# EAGLE design main (EAGLE 9.6.2)
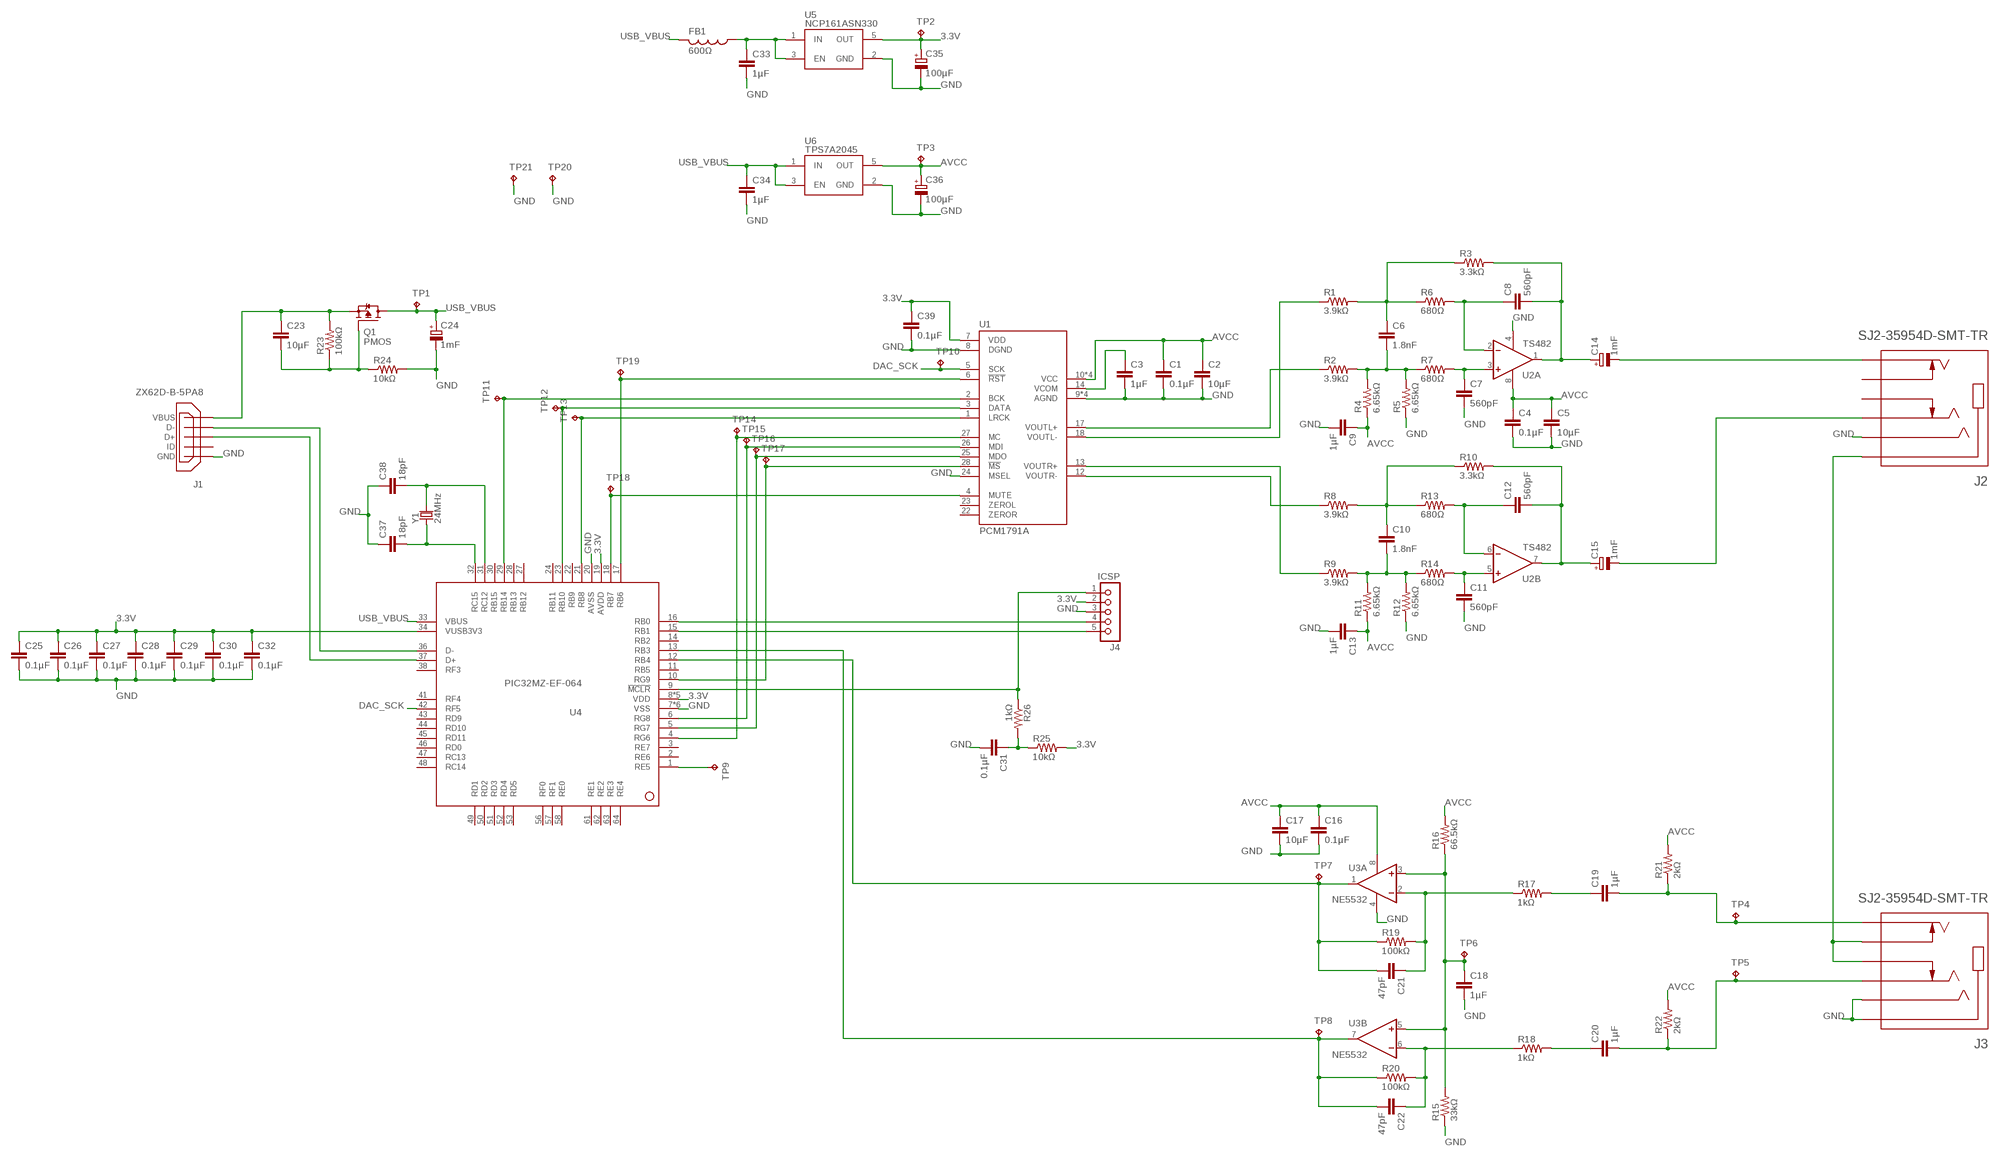
[diagram p0: schematic, sheet 1]

## Parts
C1  0.1µF  C-EUC0603  [C0603]
C2  10µF  C-EUC0805  [C0805]
C3  1µF  C-EUC0805  [C0805]
C4  0.1µF  C-EUC0603  [C0603]
C5  10µF  C-EUC0805  [C0805]
C6  1.8nF  C-EUC0603  [C0603]
C7  560pF  C-EUC0603  [C0603]
C8  560pF  C-EUC0603  [C0603]
C9  1µF  C-EUC0805  [C0805]
C10  1.8nF  C-EUC0603  [C0603]
C11  560pF  C-EUC0603  [C0603]
C12  560pF  C-EUC0603  [C0603]
C13  1µF  C-EUC0805  [C0805]
C14  1mF  CAP-E3,5-8-16-HORZ  [E3,5-8-16-HORZ]
C15  1mF  CAP-E3,5-8-16-HORZ  [E3,5-8-16-HORZ]
C16  0.1µF  C-EUC0603  [C0603]
C17  10µF  C-EUC0805  [C0805]
C18  1µF  C-EUC0805  [C0805]
C19  1µF  C-EU050-050X075  [C050-050X075]
C20  1µF  C-EU050-050X075  [C050-050X075]
C21  47pF  C-EU050-045X075  [C050-045X075]
C22  47pF  C-EU050-045X075  [C050-045X075]
C23  10µF  C-EUC0805  [C0805]
C24  1mF  CAP-E3,5-8-16-HORZ  [E3,5-8-16-HORZ]
C25  0.1µF  C-EUC0603  [C0603]
C26  0.1µF  C-EUC0603  [C0603]
C27  0.1µF  C-EUC0603  [C0603]
C28  0.1µF  C-EUC0603  [C0603]
C29  0.1µF  C-EUC0603  [C0603]
C30  0.1µF  C-EUC0603  [C0603]
C31  0.1µF  C-EUC0603  [C0603]
C32  0.1µF  C-EUC0603  [C0603]
C33  1µF  C-EUC0805  [C0805]
C34  1µF  C-EUC0805  [C0805]
C35  100µF  CPOL-EUD  [PANASONIC_D]
C36  100µF  CPOL-EUD  [PANASONIC_D]
C37  18pF  C-EUC0603  [C0603]
C38  18pF  C-EUC0603  [C0603]
C39  0.1µF  C-EUC0603  [C0603]
FB1  600Ω  0603-FERRITE  [C0603]
J1  ZX62D-B-5PA8  [ZX62D-B-5PA8]
J2  SJ2-35954D-SMT-TR  [CUI_SJ2-35954D-SMT-TR]
J3  SJ2-35954D-SMT-TR  [CUI_SJ2-35954D-SMT-TR]
J4  ICSP  5PIN-1.27  [5PIN-1.27]
Q1  PMOS  SOT23-P-MOSFET  [SOT23]
R1  3.9kΩ  R-US_R0603  [R0603]
R2  3.9kΩ  R-US_R0603  [R0603]
R3  3.3kΩ  R-US_R0603  [R0603]
R4  6.65kΩ  R-US_R0603  [R0603]
R5  6.65kΩ  R-US_R0603  [R0603]
R6  680Ω  R-US_R0603  [R0603]
R7  680Ω  R-US_R0603  [R0603]
R8  3.9kΩ  R-US_R0603  [R0603]
R9  3.9kΩ  R-US_R0603  [R0603]
R10  3.3kΩ  R-US_R0603  [R0603]
R11  6.65kΩ  R-US_R0603  [R0603]
R12  6.65kΩ  R-US_R0603  [R0603]
R13  680Ω  R-US_R0603  [R0603]
R14  680Ω  R-US_R0603  [R0603]
R15  33kΩ  R-US_R0603  [R0603]
R16  66.5kΩ  R-US_R0603  [R0603]
R17  1kΩ  R-US_R0603  [R0603]
R18  1kΩ  R-US_R0603  [R0603]
R19  100kΩ  R-US_R0603  [R0603]
R20  100kΩ  R-US_R0603  [R0603]
R21  2kΩ  R-US_R0603  [R0603]
R22  2kΩ  R-US_R0603  [R0603]
R23  100kΩ  R-US_R0603  [R0603]
R24  10kΩ  R-US_R0603  [R0603]
R25  10kΩ  R-US_R0603  [R0603]
R26  1kΩ  R-US_R0603  [R0603]
TP1  RCU-0(J)  [TP_0603_JOINED]
TP2  RCU-0(J)  [TP_0603_JOINED]
TP3  RCU-0(J)  [TP_0603_JOINED]
TP4  RCU-0(J)  [TP_0603_JOINED]
TP5  RCU-0(J)  [TP_0603_JOINED]
TP6  RCU-0(J)  [TP_0603_JOINED]
TP7  RCU-0(J)  [TP_0603_JOINED]
TP8  RCU-0(J)  [TP_0603_JOINED]
TP9  RCU-0(J)  [TP_0603_JOINED]
TP10  RCU-0(J)  [TP_0603_JOINED]
TP11  RCU-0(J)  [TP_0603_JOINED]
TP12  RCU-0(J)  [TP_0603_JOINED]
TP13  RCU-0(J)  [TP_0603_JOINED]
TP14  RCU-0(J)  [TP_0603_JOINED]
TP15  RCU-0(J)  [TP_0603_JOINED]
TP16  RCU-0(J)  [TP_0603_JOINED]
TP17  RCU-0(J)  [TP_0603_JOINED]
TP18  RCU-0(J)  [TP_0603_JOINED]
TP19  RCU-0(J)  [TP_0603_JOINED]
TP20  RCU-0(J)  [TP_0603_JOINED]
TP21  RCU-0(J)  [TP_0603_JOINED]
U1  PCM1791A  [SSOP28]
U2  TS482  [MSOP8]
U3  NE5532  [SOIC8]
U4  PIC32MZ-EF-064  [TQFP64-10X10X1MM]
U5  NCP161ASN330  SOT23-5-LDO  [SOT23-5L]
U6  TPS7A2045  SOT23-5-LDO  [SOT23-5L]
Y1  24MHz  HC49/4HSMX-CRYSTAL  [HC49/4HSMX]

## Nets
3.3V: C25.1 C26.1 C27.1 C28.1 C29.1 C30.1 C32.1 C35.+ C39.1 J4.2 R25.2 TP2.1(TP) U1.7(VDD) U4.8(VDD) U4.19(AVDD) U4.26(VDD) U4.34(VUSB3V3) U4.39(VDD) U4.54(VDD) U4.60(VDD) U5.5(OUT)
3V3REG_IN: C33.1 FB1.1 U5.1(IN) U5.3(EN)
!MCLR: J4.1 R26.1 U4.9(!MCLR)
!MCLR!_FILTER: C31.1 R25.1 R26.2
AMP_L_+: C7.1 R7.2 U2.3(A:+IN)
AMP_L_-: C8.1 R6.2 U2.2(A:-IN)
AMP_L_OUT: C8.2 C14.+ R3.2 U2.1(A:OUT)
AMP_L_SUM_+: C6.2 R2.2 R4.2 R5.2 R7.1
AMP_L_SUM_-: C6.1 R1.2 R3.1 R6.1
AMP_R_+: C11.1 R14.2 U2.5(B:+IN)
AMP_R_-: C12.1 R13.2 U2.6(B:-IN)
AMP_R_OUT: C12.2 C15.+ R10.2 U2.7(B:OUT)
AMP_R_SUM_+: C10.2 R9.2 R11.2 R12.2 R14.1
AMP_R_SUM_-: C10.1 R8.2 R10.1 R13.1
AVCC: C1.1 C2.1 C4.1 C5.1 C9.1 C13.1 C16.1 C17.1 C36.+ R4.1 R11.1 R16.2 R21.2 R22.2 TP3.1(TP) U1.10(VCC) U1.15(VCC) U1.20(VCC) U1.21(VCC) U2.8(A:V+) U3.8(A:V+) U6.5(OUT)
DAC_!MS: TP17.1(TP) U1.28(!MS) U4.10(RG9)
DAC_!RST: TP19.1(TP) U1.6(!RST) U4.17(RB6)
DAC_BCK: TP11.1(TP) U1.2(BCK) U4.29(RB14)
DAC_DATA: TP12.1(TP) U1.3(DATA) U4.23(RB10)
DAC_LRCK: TP13.1(TP) U1.1(LRCK) U4.21(RB8)
DAC_MC: TP14.1(TP) U1.27(MC) U4.4(RG6)
DAC_MISO: TP16.1(TP) U1.25(MDO) U4.5(RG7)
DAC_MOSI: TP15.1(TP) U1.26(MDI) U4.6(RG8)
DAC_MUTE: TP18.1(TP) U1.4(MUTE) U4.18(RB7)
DAC_SCK: TP10.1(TP) U1.5(SCK) U4.42(RF5)
DAC_VCOM: C3.1 U1.14(VCOM)
DAC_VOUTL+: R2.1 U1.17(VOUTL+)
DAC_VOUTL-: R1.1 U1.18(VOUTL-)
DAC_VOUTR+: R9.1 U1.13(VOUTR+)
DAC_VOUTR-: R8.1 U1.12(VOUTR-)
DEBUG_UART: TP9.1(TP) U4.1(RE5)
GND: C1.2 C2.2 C3.2 C4.2 C5.2 C7.2 C9.2 C11.2 C13.2 C16.2 C17.2 C18.2 C24.- C25.2 C26.2 C27.2 C28.2 C29.2 C30.2 C31.2 C32.2 C33.2 C34.2 C35.- C36.- C37.1 C38.1 C39.2 J1.5(GND) J1.S1(GND) J1.S2(GND) J1.S3(GND) J1.S4(GND) J2.4(RING2) J3.1(SLEEVE) J3.4(RING2) J4.3 R5.1 R12.1 R15.1 R24.2 TP20.1(TP) TP21.1(TP) U1.8(DGND) U1.9(AGND) U1.11(AGND) U1.16(AGND) U1.19(AGND) U1.24(MSEL) U2.4(A:V-) U3.4(A:V-) U4.7(VSS) U4.20(AVSS) U4.25(VSS) U4.35(VSS) U4.40(VSS) U4.55(VSS) U4.59(VSS) U5.2(GND) U6.2(GND)
HP_L: C14.- J2.2(TIP)
HP_R: C15.- J2.3(RING1)
MIC_ALT: J2.1(SLEEVE) J3.10(TIP_SWITCH) J3.11(RING1_SWITCH)
MIC_AMP_BIAS: C18.1 R15.2 R16.1 TP6.1(TP) U3.3(A:+IN) U3.5(B:+IN)
MIC_L: C19.2 J3.2(TIP) R21.1 TP4.1(TP)
MIC_L_AMPIN: C21.1 R17.1 R19.2 U3.2(A:-IN)
MIC_L_AMPOUT: C21.2 R19.1 TP7.1(TP) U3.1(A:OUT) U4.12(RB4)
MIC_L_COUPLED: C19.1 R17.2
MIC_R: C20.2 J3.3(RING1) R22.1 TP5.1(TP)
MIC_R_AMPIN: C22.1 R18.1 R20.2 U3.6(B:-IN)
MIC_R_AMPOUT: C22.2 R20.1 TP8.1(TP) U3.7(B:OUT) U4.13(RB3)
MIC_R_COUPLED: C20.1 R18.2
OSC1: C38.2 U4.31(RC12) Y1.2
OSC2: C37.2 U4.32(RC15) Y1.1
PGEC: J4.5 U4.15(RB1)
PGED: J4.4 U4.16(RB0)
USB_D+: J1.3(D+) U4.37(D+)
USB_D-: J1.2(D-) U4.36(D-)
USB_VBUS: C24.+ C34.1 FB1.2 Q1.3(D) TP1.1(TP) U4.33(VBUS) U6.1(IN) U6.3(EN)
USB_VBUS_RAMP: C23.2 Q1.1(G) R23.1 R24.1
USB_VBUS_RAW: C23.1 J1.1(VBUS) Q1.2(S) R23.2
Unconnected: J1.4(ID) J2.10(TIP_SWITCH) J2.11(RING1_SWITCH) U1.22(ZEROR) U1.23(ZEROL) U4.2(RE6) U4.3(RE7) U4.11(RB5) U4.14(RB2) U4.22(RB9) U4.24(RB11) U4.27(RB12) U4.28(RB13) U4.30(RB15) U4.38(RF3) U4.41(RF4) U4.43(RD9) U4.44(RD10) U4.45(RD11) U4.46(RD0) U4.47(RC13) U4.48(RC14) U4.49(RD1) U4.50(RD2) U4.51(RD3) U4.52(RD4) U4.53(RD5) U4.56(RF0) U4.57(RF1) U4.58(RE0) U4.61(RE1) U4.62(RE2) U4.63(RE3) U4.64(RE4)

## Library data of the parts
C1-C13 C16-C23 C25-C34 C37-C39 = rcl:C-EU: CAPACITOR, European symbol; SPICEPREFIX: C
C14 C15 C24 = BW-PassiveMechanical:CAP-E3,5-8-16-HORZ: Electrolytic capacitor, grid 3.5mm, diameter 8mm, length 16mm, horizontal mount
C35 C36 = rcl:CPOL-EU: POLARIZED CAPACITOR, European symbol; SPICEPREFIX: C
FB1 = BW-PassiveMechanical:0603-FERRITE
J1 = BW-Connectors:ZX62D-B-5PA8: Micro-USB connector, bottom mount
J2 J3 = BW-Connectors:SJ2-35954D-SMT-TR: 4 conductors, 3.5mm, SMT Audio Jack w/ 2 Switch; MANUFACTURER: CUI; PARTREV: 1.01; STANDARD: Manufacturer recommendation
J4 = BW-Connectors:5PIN-1.27: 5 pin header with 1.27mm pitch
Q1 = BW-Active:SOT23-P-MOSFET
R1-R26 = resistor:R-US_: RESISTOR, American symbol
TP1-TP21 = BW-PassiveMechanical:RCU-0: Solderable probe pad in 0603 form
U1 = BW-Active:PCM1791A: Audio DAC 24Bit 192kHz
U2 = BW-Active:TS482: 100mW Stereo Headphone Amplifier
U3 = BW-Active:NE5532: Dual OpAmp, Low noise
U4 = BW-Active:PIC32MZ-EF-064: 32-bit 200MHz microcontroller, 64-pin
U5 U6 = BW-Active:SOT23-5-LDO
Y1 = BW-PassiveMechanical:HC49/4HSMX-CRYSTAL

## Board
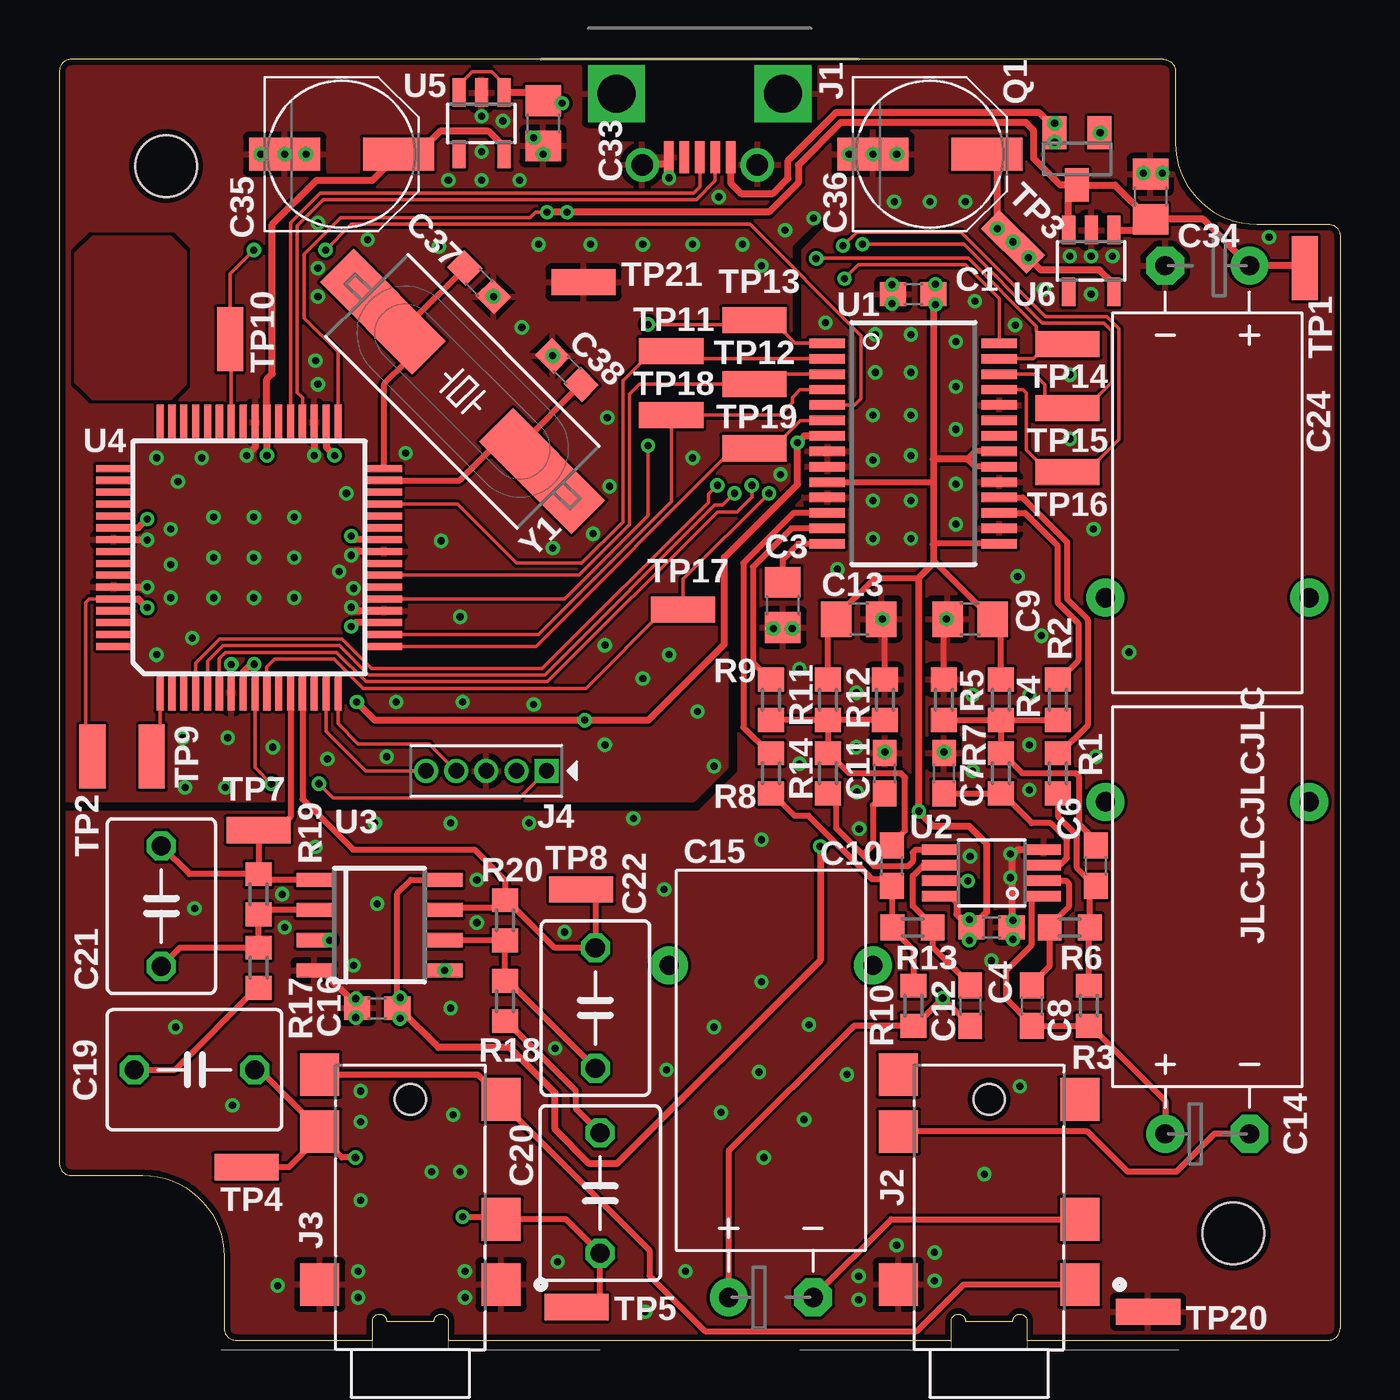
[diagram p1: board, top side]
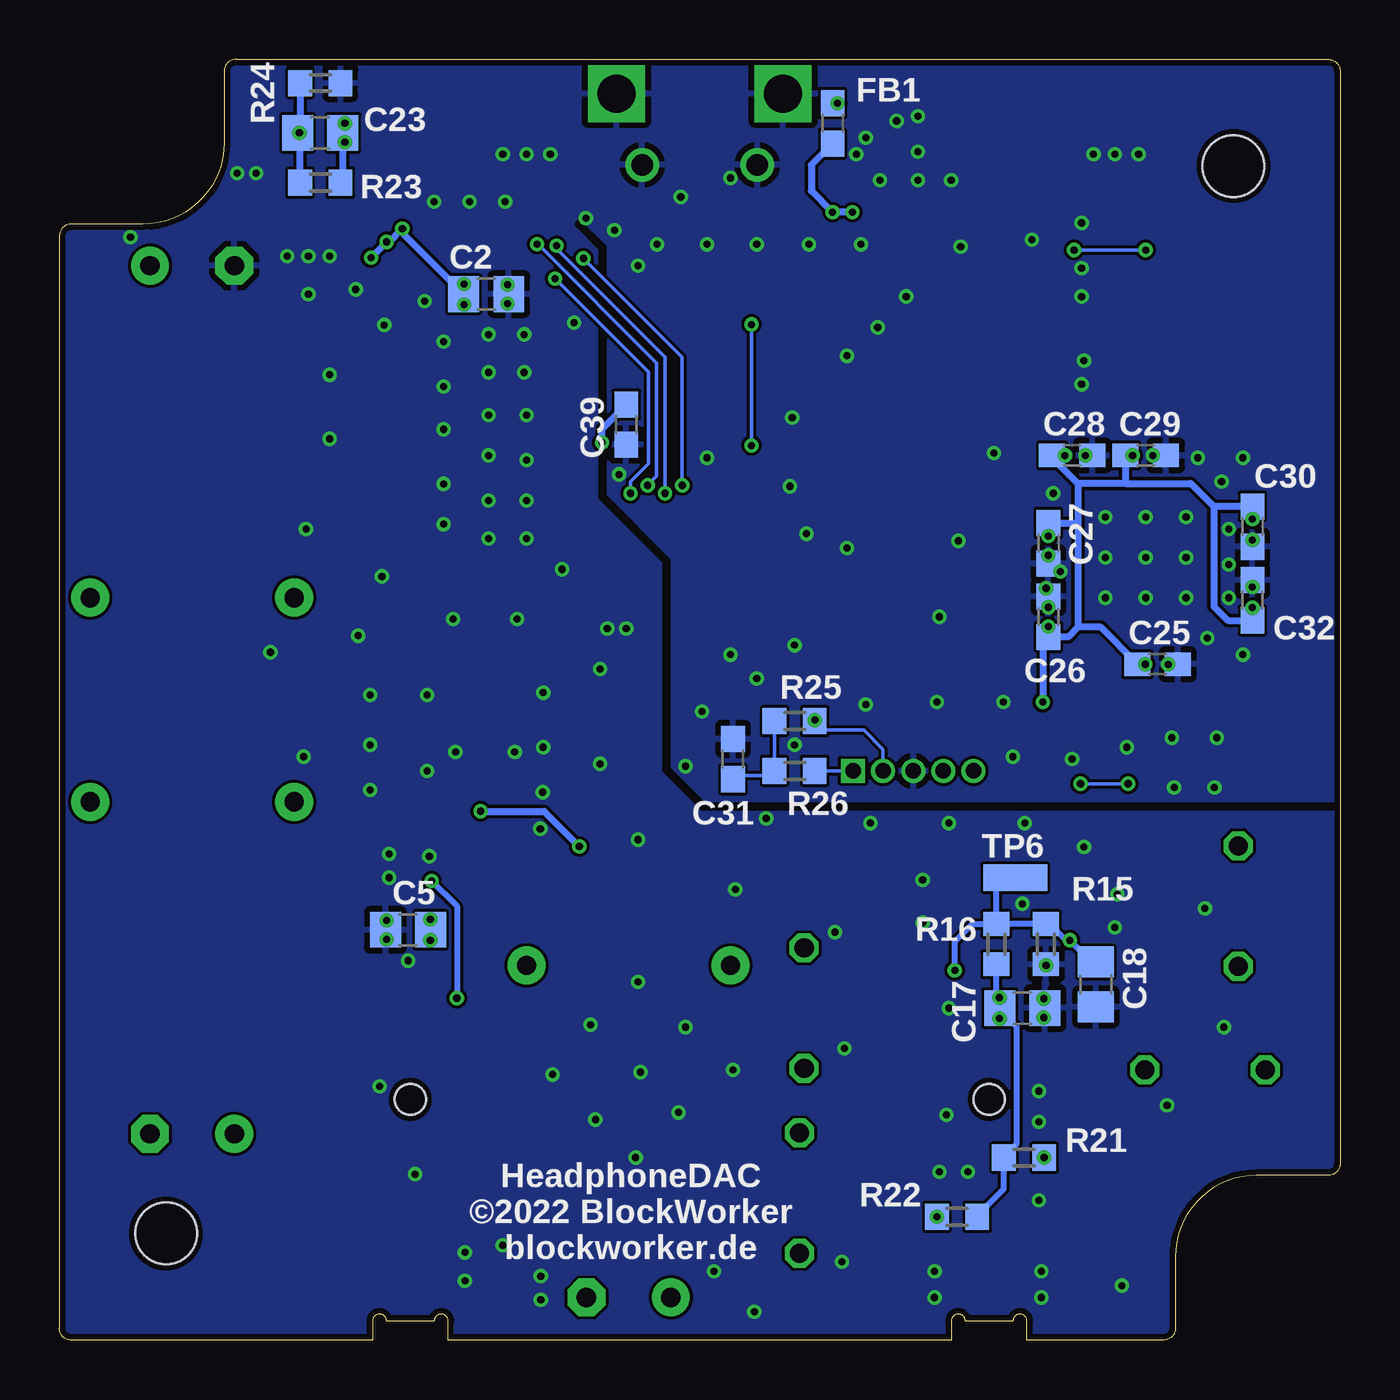
[diagram p2: board, bottom side, seen from below]

Size 54 x 54 mm. Coordinates in mm from the lower left corner, seen from the top.
Outline: 0.5,6.95 3.52,6.95 arc-90 6.95,3.52 6.95,0.5 arc90 7.45,0 13.2,0 13.2,0.8 arc-180 13.8,0.8 15.8,0.8 arc-180 16.4,0.8 16.4,0 37.6,0 37.6,0.8 arc-180 38.2,0.8 40.2,0.8 arc-180 40.8,0.8 40.8,0 53.5,0 arc90 54,0.5 54,46.55 arc90 53.5,47.05 50.48,47.05 arc-90 47.05,50.48 47.05,53.5 arc90 46.55,54 0.5,54 arc90 0,53.5 0,7.45 arc90 0.5,6.95
Copper layers (1*16): Top 0.035mm / dielectric 1.6mm / Bottom 0.035mm
Design rules "jlcpcb-2l": minimum track width 5mil, minimum drill 0.3mm, track to track 5mil, track to pad 5mil, pad to pad 5mil, via to via 5mil, smd to smd 0mil, copper to edge 0.25mm, drill to drill 0.5mm, minimum pad ring 0.15mm, minimum via ring 0.15mm, stop-mask expansion 4mil, vias tented up to drill 0.3mm, thermal gap 10mil
Holes 2.6 mm at 4.5,49.5 49.5,4.5
tKeepout: area 46.5,1.5 to 52.5,7.5; area 1.5,46.5 to 7.5,52.5

### Footprints (pad centres in the part's own frame; a part is rotated, then mirrored left to right if it is on the bottom)
C0603 = smd 1.1 x 1: 1 -0.85,0; 2 0.85,0
C0805 = smd 1.3 x 1.5: 1 -0.95,0; 2 0.95,0
E3,5-8-16-HORZ = drill 0.813 pad 1.6: + -1.778,0; M1 -4.3,14; M2 4.3,14 | drill 0.813 pad 1.6 octagon: - 1.778,0
C050-050X075 = drill 0.813 octagon: 1 -2.54,0; 2 2.54,0
C050-045X075 = drill 0.813 octagon: 1 -2.54,0; 2 2.54,0
PANASONIC_D = smd 3 x 1.4: + 2.4,0; - -2.4,0
ZX62D-B-5PA8 = smd 0.4 x 1.35: 1 3.4,4.125; 2 4.05,4.125; 3 4.7,4.125; 4 5.35,4.125; 5 6,4.125 | drill 1.6 pad 2.375 square: S1 1.188,1.45; S2 8.213,1.45 | drill 0.9 pad 1.4: S3 2.275,4.45; S4 7.125,4.45
CUI_SJ2-35954D-SMT-TR = smd 1.8 x 1.65: 1 -3.25,-3.825; 2 3.2,3.825; 3 -0.5,-3.825; 4 -3.25,3.825; 10 5.6,3.825; 11 4.55,-3.825 | hole 1.3: 4.55,0
5PIN-1.27 = drill 0.65 pad 1.016 square: 1 -2.54,0 | drill 0.65 pad 1.016: 2 -1.27,0; 3 0,0; 4 1.27,0; 5 2.54,0
SOT23 = smd 1 x 1.4: 1 -0.95,-1.1; 2 0.95,-1.1; 3 0,1.1
R0603 = smd 1 x 1.1: 1 -0.85,0; 2 0.85,0
TP_0603_JOINED = smd 2.7 x 1.1: 1 0,0
SSOP28 = smd 0.4 x 1.5: 1 -4.225,-3.625; 2 -3.575,-3.625; 3 -2.925,-3.625; 4 -2.275,-3.625; 5 -1.625,-3.625; 6 -0.975,-3.625; 7 -0.325,-3.625; 8 0.325,-3.625; 9 0.975,-3.625; 10 1.625,-3.625; 11 2.275,-3.625; 12 2.925,-3.625; 13 3.575,-3.625; 14 4.225,-3.625; 15 4.225,3.625; 16 3.575,3.625; 17 2.925,3.625; 18 2.275,3.625; 19 1.625,3.625; 20 0.975,3.625; 21 0.325,3.625; 22 -0.325,3.625; 23 -0.975,3.625; 24 -1.625,3.625; 25 -2.275,3.625; 26 -2.925,3.625; 27 -3.575,3.625; 28 -4.225,3.625
MSOP8 = smd 0.45 x 1.45: 1 -0.975,-2.2; 2 -0.325,-2.2; 3 0.325,-2.2; 4 0.975,-2.2; 5 0.975,2.2; 6 0.325,2.2; 7 -0.325,2.2; 8 -0.975,2.2
SOIC8 = smd 0.6 x 1.5: 1 -1.905,-2.75; 2 -0.635,-2.75; 3 0.635,-2.75; 4 1.905,-2.75; 5 1.905,2.75; 6 0.635,2.75; 7 -0.635,2.75; 8 -1.905,2.75
TQFP64-10X10X1MM = smd 1.5 x 0.3: 1 -5.7,3.75; 2 -5.7,3.25; 3 -5.7,2.75; 4 -5.7,2.25; 5 -5.7,1.75; 6 -5.7,1.25; 7 -5.7,0.75; 8 -5.7,0.25; 9 -5.7,-0.25; 10 -5.7,-0.75; 11 -5.7,-1.25; 12 -5.7,-1.75; 13 -5.7,-2.25; 14 -5.7,-2.75; 15 -5.7,-3.25; 16 -5.7,-3.75; 33 5.7,-3.75; 34 5.7,-3.25; 35 5.7,-2.75; 36 5.7,-2.25; 37 5.7,-1.75; 38 5.7,-1.25; 39 5.7,-0.75; 40 5.7,-0.25; 41 5.7,0.25; 42 5.7,0.75; 43 5.7,1.25; 44 5.7,1.75; 45 5.7,2.25; 46 5.7,2.75; 47 5.7,3.25; 48 5.7,3.75 | smd 0.3 x 1.5: 17 -3.75,-5.7; 18 -3.25,-5.7; 19 -2.75,-5.7; 20 -2.25,-5.7; 21 -1.75,-5.7; 22 -1.25,-5.7; 23 -0.75,-5.7; 24 -0.25,-5.7; 25 0.25,-5.7; 26 0.75,-5.7; 27 1.25,-5.7; 28 1.75,-5.7; 29 2.25,-5.7; 30 2.75,-5.7; 31 3.25,-5.7; 32 3.75,-5.7; 49 3.75,5.7; 50 3.25,5.7; 51 2.75,5.7; 52 2.25,5.7; 53 1.75,5.7; 54 1.25,5.7; 55 0.75,5.7; 56 0.25,5.7; 57 -0.25,5.7; 58 -0.75,5.7; 59 -1.25,5.7; 60 -1.75,5.7; 61 -2.25,5.7; 62 -2.75,5.7; 63 -3.25,5.7; 64 -3.75,5.7
SOT23-5L = smd 0.55 x 1.2: 1 -0.95,-1.3; 2 0,-1.3; 3 0.95,-1.3; 4 0.95,1.3; 5 -0.95,1.3
HC49/4HSMX = smd 5.5 x 2: 1 -4.75,0; 2 4.75,0

### Placement (x,y rotation side)
C1  36,44.1 180 top
C2  36,44.1 0 bottom
C3  30.5,31 270 top
C4  39.3,17.4 0 top
C5  39.3,17.3 180 bottom
C6  43.7,20 90 top
C7  37.3,23.9 90 top
C8  41,14.1 270 top
C9  38.4,30.4 180 top
C10  35.1,20 90 top
C11  34.8,23.9 90 top
C12  38.4,14.1 270 top
C13  33.7,30.4 0 top
C14  48.4,8.7 0 top
C15  30,1.8 0 top
C16  13.4,14 180 top
C17  13.4,14 0 bottom
C18  10.3,15 270 bottom
C19  5.7,11.4 0 top
C20  22.8,6.2 270 top
C21  4.3,18.3 90 top
C22  22.6,14 90 top
C23  43,50.9 180 bottom
C24  48.4,45.3 180 top
C25  7.7,28.5 0 bottom
C26  12.3,30.5 90 bottom
C27  12.3,33.6 270 bottom
C28  11.3,37.3 0 bottom
C29  8.2,37.3 0 bottom
C30  3.7,34.3 270 bottom
C31  25.6,24.5 90 bottom
C32  3.7,31.2 90 bottom
C33  20.4,51.3 270 top
C34  46,48.2 90 top
C35  11.9,50 0 top
C36  36.7,50 0 top
C37  17.7,44.6 135 top
C38  21.4,40.9 315 top
C39  30.1,38.6 270 bottom
FB1  21.4,51.3 270 bottom
J1  31.7,54 180 top
J2  39.2,5.6 90 top
J3  14.8,5.6 90 top
J4  18,24 180 top
Q1  42.9,49.8 180 top
R1  42.1,23.9 270 top
R2  42.1,27 270 top
R3  43.4,14.1 270 top
R4  39.7,27 270 top
R5  37.3,27 270 top
R6  42.6,17.4 180 top
R7  39.7,23.9 270 top
R8  30,23.9 270 top
R9  30,27 270 top
R10  36,14.1 270 top
R11  32.4,27 270 top
R12  34.8,27 270 top
R13  35.97,17.4 0 top
R14  32.4,23.9 270 top
R15  12.4,16.7 90 bottom
R16  14.5,16.7 270 bottom
R17  8.4,15.7 270 top
R18  18.8,14.3 270 top
R19  8.4,18.8 270 top
R20  18.8,17.7 270 top
R21  13.33,7.7 180 bottom
R22  16.15,5.2 0 bottom
R23  43,48.8 0 bottom
R24  43,53 0 bottom
R25  23,26.1 0 bottom
R26  23,24 180 bottom
TP1  52.5,45.2 90 top
TP2  1.4,24.6 90 top
TP3  40.2,46.3 315 top
TP4  7.9,7.3 0 top
TP5  21.8,1.4 0 top
TP6  13.7,19.5 0 bottom
TP7  8.4,21.5 0 top
TP8  22,19 0 top
TP9  3.9,24.6 90 top
TP10  7.2,42.2 90 top
TP11  25.8,41.7 0 top
TP12  29.3,40.3 0 top
TP13  29.3,43 0 top
TP14  42.5,42 0 top
TP15  42.5,39.3 0 top
TP16  42.5,36.6 0 top
TP17  26.3,30.8 0 top
TP18  25.8,39 0 top
TP19  29.3,37.6 0 top
TP20  45.9,1.2 0 top
TP21  22.1,44.6 180 top
U1  36,37.8 270 top
U2  39.3,19.7 90 top
U3  13.5,17.5 270 top
U4  8,33 90 top
U5  17.8,51.3 180 top
U6  43.5,45.5 180 top
Y1  17,40 315 top

### Tracks (layer width: path | path; a pad name or v marks a point on that pad's centre or on a via)
3.3V  (via drill 0.3)
  Top 0.152: U4.60 1.27,31.25 1.12,31.1 1.12,24.88 TP2.1
  Top 0.305: U4.8 7.75,28.17 8.08,28.5 v8.22,28.5 | U1.7 31.41,38.12 v31.12,37.84 31.12,36.08 28.04,33 28.04,29.34 24.84,26.14 v22.15,26.14 13.3,26.14 v12.54,26.9 | U5.5 18.75,50.31 18.1,50.96 16.06,50.96 15.1,50 C35.+ 13.2,48.9 10.84,48.9 8.98,47.04 8.98,40.74 8.75,40.51 U4.39 v8.75,37.3 | U4.34 11.25,37.65 v11.6,37.3 | U4.54 3.33,34.25 v3.7,34.62 | U4.60 3.33,31.25 v3.7,30.88 | U4.19 12.46,30.25 v12.3,30.09 | U4.26 12.45,33.75 v12.3,33.9
  Bottom 0.152: R25.2 22.15,26.05 21.82,25.72 20.08,25.72 19.27,24.91 J4.2
  Bottom 0.305: v31.12,37.84 31.12,38.4 30.1,39.42 C39.1 | v8.75,37.3 C29.1 9.05,36.12 | v11.6,37.3 C28.1 11.8,36.95 11.8,36.86 11.06,36.12 | v3.7,34.62 C30.1 5.31,35.15 5.32,35.14 | v3.7,30.88 C32.1 4.73,30.35 5.32,30.94 5.32,35.14 | v8.22,28.5 C25.1 10.1,30.06 11.06,30.06 | v12.3,30.09 C26.1 | v12.3,33.9 C27.1 11.06,34.45 | 9.05,36.12 11.06,36.12 | 11.06,36.12 11.06,34.45 | 11.06,34.45 11.06,30.06 | C26.1 11.47,29.65 11.06,30.06 | 9.05,36.12 6.3,36.12 5.32,35.14 | C26.1 12.54,29.41 v12.54,26.9 | R25.2 v22.15,26.14
3V3REG_IN  (via drill 0.3)
  Top 0.152: U5.1 18.75,52.95 18.22,53.48 17.4,53.48 16.85,52.93 U5.3
  Top 0.305: U5.1 20.05,52.6 C33.1 20.5,52.15 v21.2,52.15
  Bottom 0.152: FB1.1 v21.2,52.15
!MCLR  (via drill 0.3)
  Top 0.152: U4.9 8.25,24.15 v8.94,23.46 | v10.94,23.46 11.54,22.86 19.4,22.86 J4.1
  Bottom 0.152: v8.94,23.46 v10.94,23.46 | R26.1 J4.1
!MCLR!_FILTER
  Bottom 0.152: R25.1 R26.2 24.05,23.8 25.45,23.8 C31.1
AMP_L_+
  Top 0.152: 39.75,23.05 R7.2
  Top 0.254: U2.3 42.17,20.02 42.48,20.34 42.48,21.1 41.78,21.8 41,21.8 39.75,23.05 | C7.1 R7.2
AMP_L_-
  Top 0.152: 41.75,17.45 R6.2
  Top 0.254: C8.1 41,15.02 41.75,15.77 R6.2 | U2.2 42.45,19.38 42.56,19.26 42.56,18.26 41.75,17.45
AMP_L_OUT
  Top 0.254: U2.1 41.02,18.73 40.98,18.68 40.98,16.64 39.9,15.56 39.9,14.4 41,13.3 C8.2 R3.2 43.47,13.25 46.62,10.1 C14.+
AMP_L_SUM_+
  Top 0.152: 39.75,24.75 R7.1
  Top 0.254: R5.2 R4.2 | R4.2 R2.2 | R4.2 R7.1 | C6.2 43.7,21.05 43,21.75 43,23.76 42.86,23.9 40.6,23.9 39.75,24.75
AMP_L_SUM_-
  Top 0.152: C6.1 43.67,19.15
  Top 0.254: R3.1 43.4,17.35 R6.1 43.45,18.9 C6.1 | R1.2 42.1,22.08 42.9,21.28 42.9,19.92 43.67,19.15
AMP_R_+
  Top 0.254: U2.5 36.09,20.68 35.98,20.56 35.98,20.18 35.78,19.98 34.36,19.98 33.88,20.45 | R14.2 32.76,22.69 32.76,21.58 33.88,20.45 | C11.1 34.3,22.55 34.3,20.87 33.88,20.45
AMP_R_-
  Top 0.152: R13.2 36.82,17.46
  Top 0.254: C12.1 38.4,14.98 36.82,16.56 R13.2 | U2.6 36.43,20.02 35.98,19.57 35.98,18.3 36.82,17.46
AMP_R_OUT  (via drill 0.3)
  Top 0.254: U2.7 38.28,19.38 v38.3,19.36 | v37.24,14.42 v37.24,14.41 | C12.2 38.4,13.27 v37.25,14.42 v37.24,14.41 | v37.24,14.41 36.08,13.25 R10.2 33.49,13.25 28.22,7.98 C15.+
  Bottom 0.254: v38.3,19.36 37.24,18.3 v37.24,14.42
AMP_R_SUM_+
  Top 0.152: 32.45,24.75 R14.1
  Top 0.254: C10.2 35.1,20.92 35.66,21.48 35.66,23.72 35.48,23.9 33.3,23.9 32.45,24.75 | R12.2 R11.2 | R11.2 R14.1 | R11.2 R9.2
AMP_R_SUM_-
  Top 0.152: R13.1 35.12,17.34
  Top 0.254: R13.1 35.1,17.42 C10.1 34.82,19.43 34.27,19.43 31.59,22.11 31,22.11 30.06,23.05 R8.2 | R10.1 36,16.46 35.12,17.34
AVCC  (via drill 0.3)
  Top 0.254: R11.1 32.4,30.05 C13.1 32.75,30.51 34.38,32.14 36.22,32.14 | R4.1 39.7,30.05 C9.1 39.32,30.4 36.95,32.77 36.85,32.77 | U1.15 36.87,33.58 36.85,33.56 | U1.10 36.84,36.17 36.85,36.18 | U1.21 38.62,37.48 38.28,37.14 38.59,36.83 U1.20 | 14.25,14.33 C16.1 14.25,13.9 14.25,13.67 v14.36,13.56 | 14.25,14.33 14.25,18.83 14.82,19.41 U3.8 | v14.36,14.44 14.25,14.33
  Top 0.305: U2.8 37.58,18.73 37.84,18.46 37.84,17.96 38.24,17.56 | C4.1 38.4,17.4 38.24,17.56 | C4.1 39.1,18.05 39.1,20.92 38.36,21.66 36.86,21.66 36.22,22.3 | 36.85,43.75 C1.1 36.94,44.19 v36.94,44.52 | 36.85,43.75 36.85,37.14 | 36.85,37.14 36.85,36.18 36.85,33.56 36.85,32.77 36.22,32.14 36.22,22.3 | 38.28,37.14 36.85,37.14 | v36.94,43.66 36.85,43.75 | v38.36,16.86 38.45,16.95 C4.1 | v38.36,17.74 38.36,17.68 38.24,17.56 | U6.5 44.45,44.52 43.85,45.12 41.38,45.12 v40.86,45.64 | C36.+ 39.54,49.56 v39.54,46.86 | v32.08,20.82 32.08,16.02 23.5,7.44 22.34,7.44 20.9,8.88 20.9,10.42 18.98,12.34 15.98,12.34 14.42,13.9 14.25,13.9 | 36.22,22.3 v36.24,22.3
  Bottom 0.254: C17.1 v14.35,13.57 v14.36,13.56 | C17.1 v14.35,14.43 v14.36,14.44 | C17.1 14.5,14.15 R16.2 | R22.2 15.3,5.26 14.18,6.38 R21.2 14.18,7.74 13.64,8.28 13.64,13.2 14.35,13.91 C17.1
  Bottom 0.305: C2.1 v36.95,44.51 v36.94,44.52 | C2.1 v36.94,43.66 | v38.36,16.86 v38.35,16.87 C5.1 v38.35,17.73 v38.36,17.74 | C2.1 39.54,46.69 v39.54,46.86 40.1,46.3 TP3.1 v40.86,45.64 | v32.08,20.82 33.56,22.3 v36.24,22.3
  other vias: 40.2,46.3
DAC_!MS  (via drill 0.3)
  Top 0.152: U1.28 39.62,43.91 38.2,45.34 33.69,45.34 v33.1,44.76 | U4.10 8.75,28.39 9.08,28.72 11.58,28.72 12.82,27.48 22.2,27.48 25.52,30.8 TP17.1 26.3,32.08 v29.92,35.7
  Bottom 0.152: v29.92,35.7 29.92,36.2 29.16,36.96 29.16,40.81 v33.1,44.76
DAC_!RST
  Top 0.152: U4.17 20.09,29.25 28.44,37.6 TP19.1 30.08,37.6 31.25,38.77 U1.6
DAC_BCK
  Top 0.152: U4.29 16.79,35.25 19.28,32.76 22.02,32.76 23.76,34.5 23.76,40.46 25,41.7 TP11.1 26.12,41.38 U1.2
DAC_DATA
  Top 0.152: U4.23 21.91,32.25 24.04,34.38 24.04,39.88 24.46,40.3 TP12.1 29.73,40.73 U1.3
DAC_LRCK  (via drill 0.3)
  Top 0.152: U4.21 21.3,31.25 24.82,34.77 v24.82,37.72 | U1.1 31.02,42.02 30.04,43 TP13.1 29.12,42.82 v24.82,42.82
  Bottom 0.152: v24.82,37.72 v24.82,42.82
DAC_MC  (via drill 0.3)
  Top 0.152: U1.27 41.08,41.38 41.7,42 TP14.1 41.72,42 41.2,42.52 41.2,42.73 38.32,45.62 31.94,45.62 31.93,45.61 v31.91,45.61 | U4.4 5.75,28.54 6.77,29.56 11.93,29.56 13.16,28.32 20.36,28.32 27.36,35.32 27.36,35.68 27.72,36.04 v27.74,36.04
  Bottom 0.152: v27.74,36.04 27.74,41.44 v31.91,45.61
DAC_MISO  (via drill 0.3)
  Top 0.152: U1.25 40.62,40.08 40.78,39.92 40.78,37.52 41.7,36.6 TP16.1 43.3,36.6 44.66,37.96 44.66,42.66 44.16,43.16 41.57,43.16 38.01,46.72 33.62,46.72 v33.04,46.14 | U4.5 6.25,28.62 6.9,29.28 11.81,29.28 13.05,28.04 20.48,28.04 27.63,35.2 27.95,35.2 28.45,35.7 v28.47,35.7
  Bottom 0.152: v28.47,35.7 28.47,41.45 33.04,46.02 v33.04,46.14
DAC_MOSI  (via drill 0.3)
  Top 0.152: U1.26 41.12,40.73 41.56,40.28 41.56,39.54 41.54,39.52 41.76,39.3 TP15.1 43.28,39.3 44.38,40.4 44.38,42.54 44.04,42.88 41.45,42.88 38.13,46.2 v33.86,46.2 | U4.6 6.75,28.73 7.02,29 11.7,29 12.93,27.76 20.59,27.76 27.75,34.92 28.57,34.92 29.19,35.54 v29.19,36.04
  Bottom 0.152: v33.86,46.2 33.82,46.2 28.81,41.2 28.81,36.44 29.19,36.06 v29.19,36.04
DAC_MUTE
  Top 0.152: U4.18 20.2,29.75 25.8,35.35 TP18.1 30.38,39 30.9,39.52 30.9,39.74 31.23,40.08 U1.4
DAC_SCK  (via drill 0.3)
  Top 0.152: v11.22,45.96 12.3,47.04 29.12,47.04 33.8,42.36 33.8,39.7 33.52,39.42 U1.5 | U4.42 7.25,42.15 TP10.1 7.2,44.96 v8.2,45.96
  Bottom 0.152: v8.2,45.96 v11.22,45.96
DAC_VCOM
  Top 0.254: C3.1 30.5,32.92 31.16,33.58 U1.14
DAC_VOUTL+
  Top 0.254: U1.17 40.7,34.88 42.08,33.5 42.08,31.1 42.96,30.22 42.96,28.66 42.15,27.85 R2.1
DAC_VOUTL-
  Top 0.254: U1.18 40.61,35.52 42.48,33.66 42.48,31.26 43.36,30.38 43.36,25.92 42.19,24.75 R1.1
DAC_VOUTR+
  Top 0.152: 29.96,27.85 R9.1
  Top 0.254: U1.13 30.86,34.23 29.24,32.6 29.24,28.57 29.96,27.85
DAC_VOUTR-
  Top 0.254: U1.12 30.96,34.88 28.84,32.76 28.84,25.84 29.93,24.75 R8.1
DEBUG_UART
  Top 0.152: U4.1 4.25,25.69 3.9,25.34 TP9.1
GND  (via drill 0.3)
  Top 0.254: R5.1 37.3,30.25 C9.2 | R12.1 34.8,30.25 C13.2 | v7.25,28.49
  Top 0.305: U4.7 v7.25,28.49 | U4.40 8.25,37.65 v7.9,37.3 | U4.35 v10.75,37.31 v10.74,37.3 | U4.55 v3.69,33.75 v3.7,33.74 | U4.59 v3.7,31.75 | U4.20 12.45,30.75 v12.3,30.9 | U4.25 12.46,33.25 v12.3,33.09 | U3.4 11.06,15.6 12.55,14.11 C16.2 | U2.4 40.4,20.68 40.15,20.43 C4.2 | J1.5 25.7,49.6 | 25.7,49.6 v25.7,49 | J1.S4 24.62,49.6 25.7,49.6
  Bottom 0.305: v7.9,37.3 C29.2 | C28.2 v10.74,37.3 | C30.2 v3.7,33.74 | C32.2 v3.7,31.75 | C25.2 v7.25,28.5 v7.25,28.49 | v12.3,30.9 C26.2 | C27.2 v12.3,33.09
  other vias: 33.72,21.56 33.62,23.1 34.3,35.4 35.9,35.4 34.3,33.8 35.9,33.8 37.8,34.4 37.8,36.1 37.8,38.4 37.8,40.2 37.8,42.1 34.3,37.1 35.9,37.3 35.9,39 34.3,39 35.9,40.8 34.4,40.8 35.9,42.4 34.4,42.4 35.1,43.7 35.1,44.5 33.3,50 34.3,50 35.3,50 45.7,49.2 46.5,49.2 42.6,45.7 43.5,45.7 44.4,45.7 43.5,44.1 41.5,44.3 38.2,48 36.7,48 35.2,48 31.8,47.3 29.6,45.3 28.8,46.2 30.6,46.8 26.7,46.2 24.6,46.2 22.4,46.2 20.2,46.2 18.3,44 20.8,41.5 8.5,50 9.5,50 10.4,50 6,37.2 4.1,37.2 5,36.2 4.7,34.2 4.7,32.7 4.7,31.3 12.1,35.7 11.8,32.4 12.4,31.7 6.5,34.7 8.2,34.7 9.9,34.7 6.5,33 8.2,33 9.9,33 6.5,31.3 8.2,31.3 9.9,31.3 4.1,28.9 5.6,29.6 5.2,25.4 7.1,25.4 5.3,23.3 7,23.3 14.2,26.9 17,26.9 20,26.8 24.6,27.9 25.7,28.9 23,29.3 16.9,30.5 16.1,33.7 20.8,33.4 22.5,34 23.2,36 23.1,38.9 14.6,37.4 19.5,42.7 16,46.1 13,46.4 10.9,45.2 10.9,44 10.8,41.3 10.9,40.3 16.4,48.9 17.8,48.9 19.4,48.9 17.8,50.1 18.7,51.4 17.8,51.6 20,50.7 20.4,50 10.9,47.1 42.6,40.7 42.6,38 40.3,42.8 38.6,43.8 32.3,42.9 26.7,37.2 32.8,32.5 30.1,30 30.9,30 30.4,36.5 9,25 11.3,24.5 10.8,20.8 13.3,21.8 16.5,21.8 19.8,21.8 23,25.1 26.9,26.5 27.6,24.2 24.2,22 29.6,21.1 25.5,19 5.7,18.2 4.9,13.2 7.3,9.9 12.6,2.9 12.6,1.8 17.1,2.9 17.1,1.8 15.7,7.1 16.9,7.1 12.7,9.2 12.7,10.5 16.6,9.5 12.7,5.9 21,3.3 9.2,2.3 24.7,1.2 26.4,2.9 33.7,1.7 33.7,2.7 36.9,2.5 36.9,3.7 35.3,4 39,7 40.5,10.7 39.3,16 40.2,16.9 40.2,17.7 40.1,19.5 40.1,20.5 38.5,24 38.5,27.2 33.6,27.3 34.8,24.8 37.3,24.8 33.6,25 31.2,24.3 31.2,28.3 34.7,30.4 37.4,30.4 40.9,23.2 40.9,25.1 40.9,27.2 41.4,29.7 40.4,32.2 43.6,34.2 45.1,29 43.7,24.6 16.5,14 12.4,15.8 12.5,14.4 12.5,13.6 13.4,18.4 29.5,11.3 27.6,13.2 31.4,9.3 29.6,15.1 31.6,13.3 33.2,11.2 27.9,9.6 29.7,7.7 25.6,11.4 17.6,17.6 17.6,19.4 21.3,17.2 20.9,12.3 9.4,18.8 9.5,17.4 13.8,24.6 51,46.5 27.8,48.2 38.4,20.4
  pour Top (rank 6): -1,54 0,55 47,55 55,47 55,0 54,-1 7,-1 -1,7
  cutout Top (rank 6): 32.1,47.2 31,46.1 31,35.6 28.3,32.9 28.3,24.1 26.8,22.6 0.1,22.6 0.1,22.4 26.9,22.4 28.5,24 28.5,32.8 31.2,35.5 31.2,46 32.2,47 32.2,47.1
  pour Bottom (rank 6): -1,54 0,55 47,55 55,47 55,0 54,-1 7,-1 -1,7
  cutout Bottom (rank 6): 0.1,22.6 26.8,22.6 28.3,24.1 28.3,32.9 31,35.6 31,46.1 32.1,47.2 32.2,47.1 32.2,47 31.2,46 31.2,35.5 28.5,32.8 28.5,24 26.9,22.4 0.1,22.4
HP_L
  Top 0.254: C14.- 48.7,8.7 47.1,7.1 45.04,7.1 43.34,8.8 J2.2
HP_R
  Top 0.254: C15.- 35.08,5.1 J2.3
LOGO
  pour Top: 0.7,45.8 1.4,46.5 4.1,46.5 4.7,46.5 5.1,46.1 5.3,45.9 5.3,45.3 5.3,40.3 4.9,39.9 4.7,39.7 4.2,39.7 1.4,39.7 1,40.1 0.7,40.4
MIC_ALT
  Top 0.254: J3.10 17.64,11.2 18.62,10.21 J3.11 18.62,10.05 24.88,3.8 24.88,2.72 27.22,0.38 36.16,0.38 38.13,2.35 J2.1
MIC_AMP_BIAS  (via drill 0.3)
  Top 0.254: U3.3 v11.39,16.86 v11.4,16.86
  Bottom 0.254: U3.5 16.25,16.81 15.51,17.55 R16.1 | C18.1 10.49,15.95 v11.4,16.86 11.56,16.86 12.25,17.55 R15.2 R16.1 | R16.1 14.5,19.14 14.52,19.16 14.18,19.5 TP6.1
  other vias: 16.25,15.6
MIC_L  (via drill 0.3)
  Top 0.254: R21.1 11.92,7.7 10.97,8.64 J3.2 | TP4.1 9.68,7.3 10.97,8.6 J3.2 | C19.2 8.44,11.4 10.97,8.87 J3.2
  other vias: 12.48,7.7
MIC_L_AMPIN
  Top 0.254: C21.1 5.09,16.55 R17.1 R19.2 8.59,18.14 U3.2
MIC_L_AMPOUT
  Top 0.254: U3.1 8.64,19.41 R19.1 | R19.1 TP7.1 9.2,21.5 9.75,22.05 U4.12 | R19.1 5.49,19.65 C21.2
MIC_L_COUPLED
  Top 0.254: C19.1 4.88,11.4 8.33,14.85 R17.2
MIC_R  (via drill 0.3)
  Top 0.254: TP5.1 22.46,1.4 22.8,1.74 C20.2 21.36,5.1 J3.3 18.52,5.2 R22.1
  other vias: 17,5.2
MIC_R_AMPIN
  Top 0.254: U3.6 18.79,16.86 R20.2 R18.1 18.91,15.15 C22.1
MIC_R_AMPOUT
  Top 0.254: U3.7 16.36,18.24 18.49,18.24 R20.1 | R20.1 18.86,18.61 18.86,18.57 20.88,16.54 C22.2 22.6,18.64 22.24,19 TP8.1 | U4.13 10.25,22.81 12.38,20.68 17.5,20.68 18.8,19.39 R20.1
MIC_R_COUPLED
  Top 0.254: C20.1 21.78,9.76 21.78,10.52 18.85,13.45 R18.2
OSC1
  Top 0.254: U4.31 16.87,36.25 18.28,37.66 19.34,37.66 19.4,37.6 | 19.4,37.6 Y1.2 | C38.2 19.4,37.7 19.4,37.6
OSC2
  Top 0.254: U4.32 13.7,40.32 14.64,41.26 14.64,42.36 14.45,42.55 14.62,42.72 | C37.2 14.62,42.72 | Y1.1 13.98,43.36 14.62,42.72
PGEC
  Top 0.152: U4.15 11.25,25.67 12.92,24 J4.5
PGED
  Top 0.152: U4.16 11.75,25.99 12.6,25.14 15.59,25.14 J4.4
USB_D+
  Top 0.152: J1.3 27,48.62 26.74,48.36 11,48.36 9.75,47.11 U4.37
USB_D-
  Top 0.152: J1.2 27.65,48.88 26.86,48.08 11.12,48.08 10.03,46.99 10.03,39.95 10.25,39.73 U4.36
USB_VBUS  (via drill 0.3)
  Top 0.152: v20.56,47.56 20.08,47.56 19.84,47.32 11.86,47.32 10.33,45.79 10.33,43.09 11.75,41.67 U4.33
  Top 0.305: Q1.3 44.5,48.7 45.95,47.25 C34.1 | U6.1 45.56,46.8 C34.1 | U6.3 42.55,48.05 42.9,48.4 Q1.3 | C34.1 48.23,47.25 C24.+ 52.4,45.3 TP1.1 | Q1.3 42.2,48.7 41.08,49.82 41.08,51 40.75,51.33 32.94,51.33 31.15,49.54 31.15,48.8 29.91,47.56 v21.4,47.56 v20.56,47.56
  Bottom 0.305: FB1.2 22.3,49.55 22.3,48.46 v21.4,47.56 v20.56,47.56
USB_VBUS_RAMP  (via drill 0.3)
  Top 0.305: v43.88,50.9 Q1.1
  Bottom 0.305: C23.2 v43.88,50.9 | R24.1 43.85,51 C23.2 | R23.1 43.85,50.8 C23.2
USB_VBUS_RAW  (via drill 0.3)
  Top 0.305: J1.1 28.3,48.78 28.74,48.34 30.08,48.34 30.72,48.98 30.72,49.72 32.76,51.76 41.29,51.76 41.95,51.1 Q1.2 v41.96,51.3
  Bottom 0.305: v41.96,51.3 42.05,51.21 C23.1 | v41.96,50.5 42.05,50.59 C23.1 | C23.1 42.05,48.9 R23.2

### Text on the board
tPlace: JLCJLCJLCJLC
bPlace: HeadphoneDAC / ©2022 BlockWorker / blockworker.de